# Altium schematic sheet Power.SchDoc
size A4; SheetNumber: 1; SheetTotal: 3
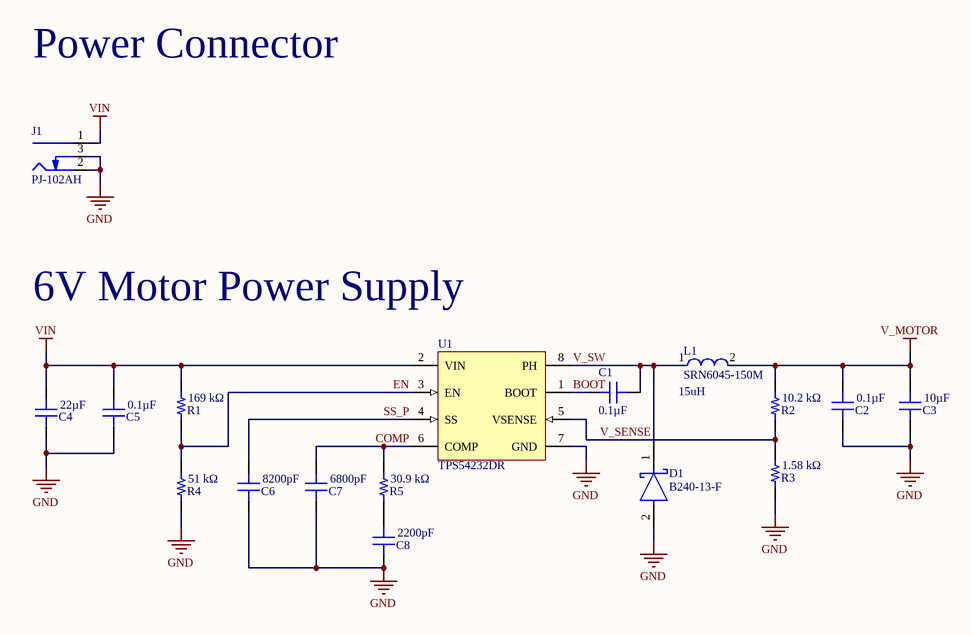
[diagram p0: Power.SchDoc]

## Parts
C1  0.1µF  [CAP 0603_1608]
C2  0.1µF  [CAP 0603_1608]
C3  10µF  [CAP 0805_2012]
C4  22µF  [CAP 0805_2012]
C5  0.1µF  [CAP 0603_1608]
C6  8200pF  [CAP 0603_1608]
C7  6800pF  [CAP 0603_1608]
C8  2200pF  [CAP 0603_1608]
D1  B240-13-F  [FP-SMB-MFG]
J1  PJ-102AH  [CUI PJ-102AH]
L1  SRN6045-150M  Inductance: 15uH  [FP-SRN6045-MFG]
R1  169 kΩ  [RES 0603_1608]
R2  10.2 kΩ  [RES 0603_1608]
R3  1.58 kΩ  [RES 0603_1608]
R4  51 kΩ  [RES 0603_1608]
R5  30.9 kΩ  [RES 0603_1608]
U1  TPS54232DR  [D0008A_M]

## Nets
GND: C2.1 C3.1 C4.1 C5.1 C6.1 C7.1 C8.1 D1.2(A) J1.2(Outer) J1.3(SW) R3.1 R4.1 U1.7(GND)
V_MOTOR: C2.2 C3.2 L1.2 R2.2
VIN: C4.2 C5.2 J1.1(Centre) R1.2 U1.2(VIN)
BOOT: C1.2 U1.1(BOOT)
COMP: C7.2 R5.2 U1.6(COMP)
EN: R1.1 R4.2 U1.3(EN)
SS_P: C6.2 U1.4(SS)
V_SENSE: R2.1 R3.2 U1.5(VSENSE)
V_SW: C1.1 D1.1(C) L1.1 U1.8(PH)
NetC8_2: C8.2 R5.1

## Notes on the sheet
- Power Connector
- 6V Motor Power Supply

## Library data of the parts
C1 C2 C5 = 06033C104JAT2A: CAP CER 0.1UF 25V X7R 0603; Manufacturer: AVX Corporation; Tolerance: ±5%; Part Number: 06033C104JAT2A; Applications: General Purpose; Capacitance: 0.1µF; ComponentLink1Description: Datasheet; ComponentLink1URL: http://datasheets.avx.com/X7RDielectric.pdf; ComponentLink2Description: DigiKey Link; ComponentLink2URL: http://digikey.com/product-detail/en/avx-corporation/06033C104JAT2A/478-3713-1-ND/1116411; Device Package: 0603 (1608 Metric); LastUpdated: 2/3/2020 5:05:47 PM; Lifecycle Status: Active; Minimum Order: 1; Mounting Type: Surface Mount, MLCC; Operating Temperature: -55°C ~ 125°C; Package / Case: 0603 (1608 Metric); Packaging: TapeAndReel; Part Status: Active; Price: 0.07; Series: -; Size / Dimension: 0.063" L x 0.032" W (1.60mm x 0.81mm); Supplier 1: DigiKey; Supplier Part Number 1: 478-3713-1-ND; Temperature Coefficient: X7R; Thickness (Max): 0.035" (0.90mm); Value: 0.1µF; Voltage - Rated: 25V
C3 = 08053D106KAT2A: CAP CER 10UF 25V X5R 0805; Manufacturer: AVX Corporation; Tolerance: ±10%; Part Number: 08053D106KAT2A; Applications: General Purpose; Capacitance: 10µF; ComponentLink1Description: Datasheet; ComponentLink1URL: http://datasheets.avx.com/cx5r.pdf; ComponentLink2Description: DigiKey Link; ComponentLink2URL: http://digikey.com/product-detail/en/avx-corporation/08053D106KAT2A/478-7436-1-ND/3660337; Device Package: 0805 (2012 Metric); LastUpdated: 2/3/2020 5:07:41 PM; Lifecycle Status: Active; Minimum Order: 1; Mounting Type: Surface Mount, MLCC; Operating Temperature: -55°C ~ 85°C; Package / Case: 0805 (2012 Metric); Packaging: TapeAndReel; Part Status: Active; Price: 0.13; Series: -; Size / Dimension: 0.079" L x 0.049" W (2.00mm x 1.25mm); Supplier 1: DigiKey; Supplier Part Number 1: 478-7436-1-ND; Temperature Coefficient: X5R; Thickness (Max): 0.051" (1.30mm); Value: 10µF; Voltage - Rated: 25V
C4 = C2012X5R1E226M125AC: CAP CER 22UF 25V X5R 0805; Manufacturer: TDK Corporation; Tolerance: ±20%; Part Number: C2012X5R1E226M125AC; Applications: General Purpose; Capacitance: 22µF; ComponentLink1Description: Datasheet; ComponentLink1URL: https://product.tdk.com/info/en/catalog/datasheets/mlcc_commercial_general_en.pdf?ref_disty=digikey; ComponentLink2Description: DigiKey Link; ComponentLink2URL: http://digikey.com/product-detail/en/tdk-corporation/C2012X5R1E226M125AC/445-9112-1-ND/3661660; Device Package: 0805 (2012 Metric); Features: Low ESL; LastUpdated: 2/3/2020 5:06:58 PM; Lifecycle Status: Active; Minimum Order: 1; Mounting Type: Surface Mount, MLCC; Operating Temperature: -55°C ~ 85°C; Package / Case: 0805 (2012 Metric); Packaging: TapeAndReel; Part Status: Active; Price: 1.18; Series: C; Size / Dimension: 0.079" L x 0.049" W (2.00mm x 1.25mm); Supplier 1: DigiKey; Supplier Part Number 1: 445-9112-1-ND; Temperature Coefficient: X5R; Thickness (Max): 0.057" (1.45mm); Value: 22µF; Voltage - Rated: 25V
C6 = 06035C822KAT2A: CAP CER 8200PF 50V X7R 0603; Manufacturer: AVX Corporation; Tolerance: ±10%; Part Number: 06035C822KAT2A; Applications: General Purpose; Capacitance: 8200pF; ComponentLink1Description: Datasheet; ComponentLink1URL: http://datasheets.avx.com/X7RDielectric.pdf; ComponentLink2Description: DigiKey Link; ComponentLink2URL: http://digikey.com/product-detail/en/avx-corporation/06035C822KAT2A/478-1226-1-ND/564258; Device Package: 0603 (1608 Metric); LastUpdated: 2/3/2020 5:05:05 PM; Lifecycle Status: Active; Minimum Order: 1; Mounting Type: Surface Mount, MLCC; Operating Temperature: -55°C ~ 125°C; Package / Case: 0603 (1608 Metric); Packaging: TapeAndReel; Part Status: Active; Price: 0.02; Series: -; Size / Dimension: 0.063" L x 0.032" W (1.60mm x 0.81mm); Supplier 1: DigiKey; Supplier Part Number 1: 478-1226-1-ND; Temperature Coefficient: X7R; Thickness (Max): 0.035" (0.90mm); Value: 8200pF; Voltage - Rated: 50V
C7 = 06033C682JAT2A: CAP CER 6800PF 25V X7R 0603; Manufacturer: AVX Corporation; Tolerance: ±5%; Part Number: 06033C682JAT2A; Applications: General Purpose; Capacitance: 6800pF; ComponentLink1Description: Datasheet; ComponentLink1URL: http://datasheets.avx.com/X7RDielectric.pdf; ComponentLink2Description: DigiKey Link; ComponentLink2URL: http://digikey.com/product-detail/en/avx-corporation/06033C682JAT2A/478-12687-1-ND/9949222; Device Package: 0603 (1608 Metric); LastUpdated: 2/3/2020 5:06:06 PM; Lifecycle Status: Active; Minimum Order: 1; Mounting Type: Surface Mount, MLCC; Operating Temperature: -55°C ~ 125°C; Package / Case: 0603 (1608 Metric); Packaging: TapeAndReel; Part Status: Active; Price: 0.05; Series: -; Size / Dimension: 0.063" L x 0.032" W (1.60mm x 0.81mm); Supplier 1: DigiKey; Supplier Part Number 1: 478-12687-1-ND; Temperature Coefficient: X7R; Thickness (Max): 0.035" (0.90mm); Value: 6800pF; Voltage - Rated: 25V
C8 = 06033C222JAT2A: CAP CER 2200PF 25V X7R 0603; Manufacturer: AVX Corporation; Tolerance: ±5%; Part Number: 06033C222JAT2A; Applications: General Purpose; Capacitance: 2200pF; ComponentLink1Description: Datasheet; ComponentLink1URL: http://datasheets.avx.com/X7RDielectric.pdf; ComponentLink2Description: DigiKey Link; ComponentLink2URL: http://digikey.com/product-detail/en/avx-corporation/06033C222JAT2A/478-12683-1-ND/9949218; Device Package: 0603 (1608 Metric); LastUpdated: 2/3/2020 5:05:43 PM; Lifecycle Status: Active; Minimum Order: 1; Mounting Type: Surface Mount, MLCC; Operating Temperature: -55°C ~ 125°C; Package / Case: 0603 (1608 Metric); Packaging: TapeAndReel; Part Status: Active; Price: 0.01; Series: -; Size / Dimension: 0.063" L x 0.032" W (1.60mm x 0.81mm); Supplier 1: DigiKey; Supplier Part Number 1: 478-12683-1-ND; Temperature Coefficient: X7R; Thickness (Max): 0.035" (0.90mm); Value: 2200pF; Voltage - Rated: 25V
D1 = CMP-12790-000044-1: DIODE SCHOTTKY 40V 2A SMB; Manufacturer: Diodes Inc.; Capacitance: 200pF; Peak Reverse Current: 0.5mA; Max Junction Temp: +150°C; Value: 200pF; Max Surge Forward Current: 50A; Standoff Height: 0.05mm; Forward Current: 2A; Device Class L2: Diodes; Device Class L1: Discrete Semiconductors; Reverse Voltage: 40V; Automotive: No; Lead Free: Yes; Octopart: https://octopart.com/b240-13-f-diodes+inc.-325780; Device Class L3: Schottky Diodes; Temperature Range Low: -65°C; RoHS: TRUE; Category: Diode; Max Repetitive Reverse Voltage: 40V; Temperature: -65°C to +150°C; ComponentLink2URL: https://www.diodes.com/assets/Datasheets/ds13004.pdf; Manufacturer Part Number: B240-13-F; Mouser Description: Schottky Diodes & Rectifiers 40V 2A; Temperature Range High: +150°C; Package: SMB; ComponentLink2Description: Datasheet; Footprint Url: https://www.diodes.com/assets/Package-Files/SMB.pdf; Height: 2.5mm; Digikey Description: DIODE SCHOTTKY 40V 2A SMB
J1 = PJ-102AH: CONN PWR JACK 2X5.5MM SOLDER; Manufacturer: CUI Devices; Actual Diameter: 0.079" (2.00mm ID), 0.256" (6.50mm OD); Current Rating (Amps): 5A; Gender: Male; Industry Recognized Mating Diameter: 2.00mm ID (0.079"), 5.50mm OD (0.217"); Internal Switch(s): Single Switch, Normally Closed; Material Flammability Rating: UL94 V-0; Mating Length/Depth: 0.354" (9.00mm); Number of Positions/Contacts: 2 Conductors, 3 Contacts; Shielding: Unshielded; Voltage - Rated: 24VDC; Part Number: PJ-102AH; ComponentLink1Description: Datasheet; ComponentLink1URL: https://www.cuidevices.com/product/resource/digikeypdf/pj-102ah.pdf; ComponentLink2Description: DigiKey Link; ComponentLink2URL: //digikey.com/product-detail/en/cui-devices/PJ-102AH/CP-102AH-ND/408448; Connector Type: Jack; LastUpdated: 2/3/2020 5:11:42 PM; Lifecycle Status: 0; Minimum Order: 1; Mounting Type: Through Hole, Right Angle; Packaging: Tray; Part Status: Active; Price: 0.76; Series: -; Supplier 1: DigiKey; Supplier Part Number 1: CP-102AH-ND; Termination: Solder
L1 = CMP-07248-000050-1: FIXED IND 15UH 1.9A 95.8MOHM SMD; Inductance Tolerance: 20%; Self Resonant Frequency: 13MHz; Saturation Current: 2.3A; Core Material: Ferrite; Shielding: Shielded; DC Resistance (DCR): 95.8mR; Test Frequency: 100kHz; Termination: SMD/SMT; Depth: 6.2mm; Max DC Current: 1.9A; Height: 4.5mm; Max Operating Temperature: 125°C; Package Quantity: 1000; Resistor Type: Wirewound; Min Operating Temperature: -40°C; Width: 6mm; Weight: 0.027725oz; Mount: Surface Mount; Length: 6mm; Series: SRN6045; Packaging: Tape and Reel; DC Current: 1.9A; Number of Pins: 2; Military Standard: Not; REACH SVHC: No SVHC; Tolerance: 20%; Height - Seated (Max): 0.177inch; Current Rating: 1.9A; Case/Package: Nonstandard; RMS Current (Irms): 1.9A
R1 = RC0603FR-07169KL: RES SMD 169K OHM 1% 1/10W 0603; Manufacturer: Yageo; Power (Watts): 0.1W, 1/10W; Temperature Coefficient: ±100ppm/°C; Value: 169 kOhms; Part Number: RC0603FR-07169KL; ComponentLink1Description: Datasheet; ComponentLink1URL: https://www.yageo.com/upload/media/product/productsearch/datasheet/rchip/PYu-RC_Group_51_RoHS_L_10.pdf; ComponentLink2Description: DigiKey Link; ComponentLink2URL: http://digikey.com/product-detail/en/yageo/RC0603FR-07169KL/311-169KHRCT-ND/729926; Composition: Thick Film; Device Package: 0603 (1608 Metric); Features: Moisture Resistant; Height - Seated (Max): 0.022" (0.55mm); LastUpdated: 2/19/2020 6:28:06 AM; Lifecycle Status: Active; Minimum Order: 1; Number of Terminations: 2; Operating Temperature: -55°C ~ 155°C; Package / Case: 0603 (1608 Metric); Packaging: CutTape; Part Status: Active; Price: 0.10; Resistance: 169 kΩ; Series: RC; Size / Dimension: 0.063" L x 0.031" W (1.60mm x 0.80mm); Supplier 1: DigiKey; Supplier Part Number 1: 311-169KHRCT-ND; Supplier Device Package: 0603; Tolerance: ±1%
R2 = AC0603FR-0710K2L: RES SMD 10.2K OHM 1% 1/10W 0603; Manufacturer: Yageo; Power (Watts): 0.1W, 1/10W; Temperature Coefficient: ±100ppm/°C; Value: 10.2 kOhms; Part Number: AC0603FR-0710K2L; ComponentLink1Description: Datasheet; ComponentLink1URL: https://www.yageo.com/upload/media/product/productsearch/datasheet/rchip/PYu-AC_51_RoHS_L_7.pdf; ComponentLink2Description: DigiKey Link; ComponentLink2URL: http://digikey.com/product-detail/en/yageo/AC0603FR-0710K2L/YAG5317CT-ND/7063660; Composition: Thick Film; Device Package: 0603 (1608 Metric); Features: Automotive AEC-Q200, Moisture Resistant; Height - Seated (Max): 0.022" (0.55mm); LastUpdated: 2/19/2020 6:28:06 AM; Lifecycle Status: Active; Minimum Order: 1; Number of Terminations: 2; Operating Temperature: -55°C ~ 155°C; Package / Case: 0603 (1608 Metric); Packaging: CutTape; Part Status: Active; Price: 0.10; Ratings: AEC-Q200; Resistance: 10.2 kΩ; Series: AC; Size / Dimension: 0.063" L x 0.031" W (1.60mm x 0.80mm); Supplier 1: DigiKey; Supplier Part Number 1: YAG5317CT-ND; Supplier Device Package: 0603; Tolerance: ±1%
R3 = CR0603-FX-1581ELF: RES SMD 1.58K OHM 1% 1/10W 0603; Manufacturer: Bourns Inc.; Power (Watts): 0.1W, 1/10W; Temperature Coefficient: ±100ppm/°C; Value: 1.58 kOhms; Part Number: CR0603-FX-1581ELF; ComponentLink1Description: Datasheet; ComponentLink1URL: https://www.bourns.com/docs/Product-Datasheets/CHPREZTR.pdf; ComponentLink2Description: DigiKey Link; ComponentLink2URL: http://digikey.com/product-detail/en/bourns-inc/CR0603-FX-1581ELF/CR0603-FX-1581ELFCT-ND/8601999; Composition: Thick Film; Device Package: 0603 (1608 Metric); Features: Moisture Resistant; Height - Seated (Max): 0.022" (0.55mm); LastUpdated: 2/19/2020 6:28:06 AM; Lifecycle Status: Active; Minimum Order: 1; Number of Terminations: 2; Operating Temperature: -55°C ~ 155°C; Package / Case: 0603 (1608 Metric); Packaging: TapeAndReel; Part Status: Active; Price: 0.01; Resistance: 1.58 kΩ; Series: CR0603; Size / Dimension: 0.063" L x 0.031" W (1.60mm x 0.80mm); Supplier 1: DigiKey; Supplier Part Number 1: CR0603-FX-1581ELFCT-ND; Supplier Device Package: 0603; Tolerance: ±1%
R4 = AC0603FR-0751KL: RES SMD 51K OHM 1% 1/10W 0603; Manufacturer: Yageo; Power (Watts): 0.1W, 1/10W; Temperature Coefficient: ±100ppm/°C; Value: 51 kOhms; Part Number: AC0603FR-0751KL; ComponentLink1Description: Datasheet; ComponentLink1URL: https://www.yageo.com/upload/media/product/productsearch/datasheet/rchip/PYu-AC_51_RoHS_L_7.pdf; ComponentLink2Description: DigiKey Link; ComponentLink2URL: http://digikey.com/product-detail/en/yageo/AC0603FR-0751KL/YAG3616CT-ND/6006465; Composition: Thick Film; Device Package: 0603 (1608 Metric); Features: Automotive AEC-Q200, Moisture Resistant; Height - Seated (Max): 0.022" (0.55mm); LastUpdated: 2/19/2020 6:28:06 AM; Lifecycle Status: Active; Minimum Order: 1; Number of Terminations: 2; Operating Temperature: -55°C ~ 155°C; Package / Case: 0603 (1608 Metric); Packaging: CutTape; Part Status: Active; Price: 0.10; Ratings: AEC-Q200; Resistance: 51 kΩ; Series: AC; Size / Dimension: 0.063" L x 0.031" W (1.60mm x 0.80mm); Supplier 1: DigiKey; Supplier Part Number 1: YAG3616CT-ND; Supplier Device Package: 0603; Tolerance: ±1%
R5 = CR0603-FX-3092ELF: RES SMD 30.9K OHM 1% 1/10W 0603; Manufacturer: Bourns Inc.; Power (Watts): 0.1W, 1/10W; Temperature Coefficient: ±100ppm/°C; Value: 30.9 kOhms; Part Number: CR0603-FX-3092ELF; ComponentLink1Description: Datasheet; ComponentLink1URL: https://www.bourns.com/docs/Product-Datasheets/CHPREZTR.pdf; ComponentLink2Description: DigiKey Link; ComponentLink2URL: http://digikey.com/product-detail/en/bourns-inc/CR0603-FX-3092ELF/CR0603-FX-3092ELFCT-ND/8602027; Composition: Thick Film; Device Package: 0603 (1608 Metric); Features: Moisture Resistant; Height - Seated (Max): 0.022" (0.55mm); LastUpdated: 2/19/2020 6:28:06 AM; Lifecycle Status: Active; Minimum Order: 1; Number of Terminations: 2; Operating Temperature: -55°C ~ 155°C; Package / Case: 0603 (1608 Metric); Packaging: TapeAndReel; Part Status: Active; Price: 0.01; Resistance: 30.9 kΩ; Series: CR0603; Size / Dimension: 0.063" L x 0.031" W (1.60mm x 0.80mm); Supplier 1: DigiKey; Supplier Part Number 1: CR0603-FX-3092ELFCT-ND; Supplier Device Package: 0603; Tolerance: ±1%
U1 = CMP-0323-00201-3: Buck Step Down Regulator with 3.5 to 28 V Input and 0.8 to 25 V Output, -40 to 150 degC, 8-Pin SOIC (D), Green (RoHS & no Sb/Br); Manufacturer: Texas Instruments; Rating: Catalog; Duty Cycle(Max)(%): 90; Vout(Max)(V): 25; Switch Current Limit(Typ)(A): 2.3; Iout(Max)(A): 2; Vout(Min)(V): 0.8; Regulated Outputs(#): 1; Vin(Min)(V): 3.5; Iq(Typ)(mA): 0.11; SubFamily: Step-Down Regulator; Vin(Max)(V): 28; Code_JEDEC: MS-012AA; Mounting Technology: Surface Mount; Topology: Buck; PackageDescription: 8-Pin Plastic Small Outline Integrated Circuit, 4.9 x 3.9 mm, Pitch 1.27 mm Pitch; DatasheetVersion: SLVS876B; Eco-Plan: Green (RoHS & no Sb/Br); ComponentLink2Description: Package Specification; ComponentLink3Description: URL Link1; PackageReference: D0008A; ComponentLink2URL: http://www.ti.com/litv/pdf/msoi002j; PackageVersion: revM, Jun-2011; PartNumber: TPS54232DR; ComponentLink1URL: http://www.ti.com/general/docs/lit/getliterature.tsp?genericPartNumber=TPS54232&fileType=pdf; ComponentLink3URL: Samples URL:http://www.ti.com/product/tps54611#samples; ComponentLink1Description: Datasheet